# Altium schematic sheet STM32F103C6T7A.SchDoc
size A4
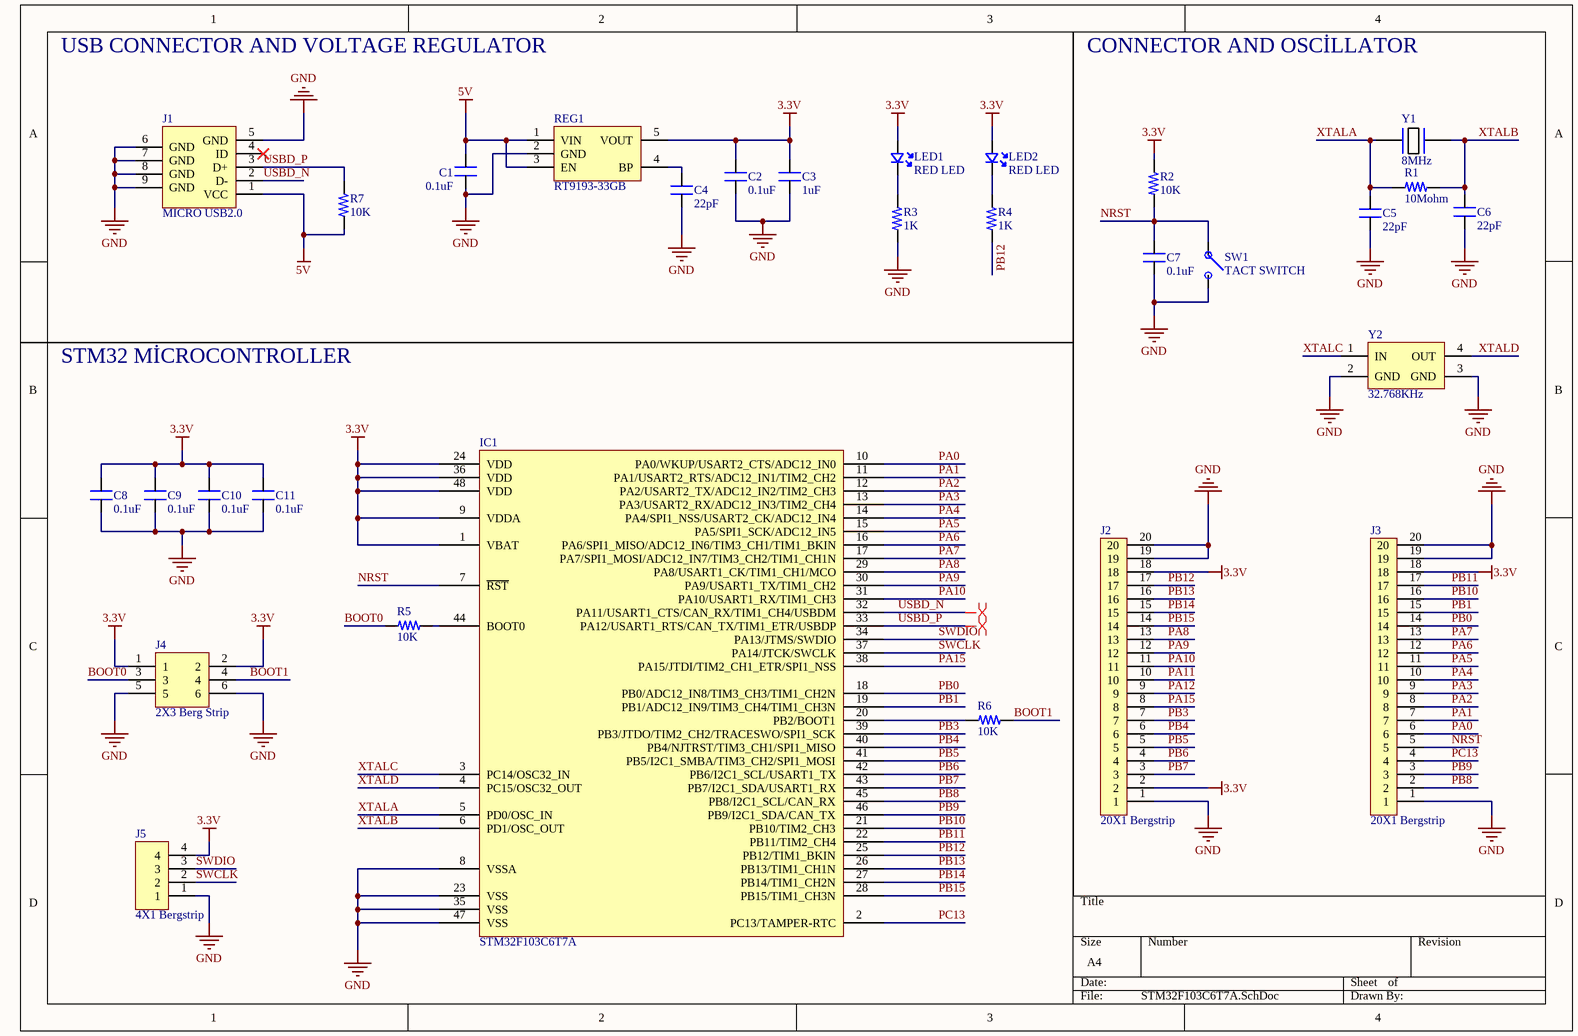
[diagram p0: STM32F103C6T7A.SchDoc]

## Parts
C1  0.1uF  [CAP_0805]
C2  0.1uF  [CAP_0805]
C3  1uF  [CAP_0805]
C4  22pF  [CAP_0805]
C5  22pF  [CAP_0805]
C6  22pF  [CAP_0805]
C7  0.1uF  [CAP_0805]
C8  0.1uF  [CAP_0805]
C9  0.1uF  [CAP_0805]
C10  0.1uF  [CAP_0805]
C11  0.1uF  [CAP_0805]
IC1  STM32F103C6T7A  [ST LQFP-48 7X7MM]
J1  MICRO USB2.0  [CON_10118192-0001LF_SMD]
J2  20X1 Bergstrip  [CON20_100_40D72_TH_ST]
J3  20X1 Bergstrip  [CON20_100_40D72_TH_ST]
J4  2X3 Berg Strip  [CON6_100_59D78_TH_ST_Duplicate]
J5  4X1 Bergstrip  [CON4_100_40D72_TH_ST_MALE]
LED1  RED LED  [LED_0805]
LED2  RED LED  [LED_0805]
R1  10Mohm  [RES_0805]
R2  10K  [RES_0805]
R3  1K  [RES_0805]
R4  1K  [RES_0805]
R5  10K  [RES_0805]
R6  10K  [RES_0805]
R7  10K  [RES_0805]
REG1  RT9193-33GB  [SOT23-5]
SW1  TACT SWITCH  [SW_342_SMD]
Y1  8MHz  [XTAL_314_240X47_SMD]
Y2  32.768KHz  [XTAL_MC-405 32.7680K-G3]

## Nets
3.3V: C2.2 C3.2 C8.2 C9.2 C10.2 C11.2 IC1.1(VBAT) IC1.9(VDDA) IC1.24(VDD) IC1.36(VDD) IC1.48(VDD) J2.2 J2.18 J3.18 J4.1 J4.2 J5.4 LED1.A LED2.A R2.2 REG1.5(VOUT)
5V: C1.2 J1.1(VCC) R7.1 REG1.1(VIN) REG1.3(EN)
GND: C1.1 C2.1 C3.1 C4.1 C5.1 C6.1 C7.1 C8.1 C9.1 C10.1 C11.1 IC1.8(VSSA) IC1.23(VSS) IC1.35(VSS) IC1.47(VSS) J1.5(GND) J1.6(GND) J1.7(GND) J1.8(GND) J1.9(GND) J2.1 J2.19 J2.20 J3.1 J3.19 J3.20 J4.5 J4.6 J5.1 R3.1 REG1.2(GND) SW1.2 Y2.2(GND) Y2.3(GND)
BOOT0: J4.3 R5.1
BOOT1: J4.4 R6.2
NRST: C7.2 IC1.7(~{RST}) J3.5 R2.1 SW1.1
PA0: IC1.10(PA0/WKUP/USART2_CTS/ADC12_IN0) J3.6
PA1: IC1.11(PA1/USART2_RTS/ADC12_IN1/TIM2_CH2) J3.7
PA2: IC1.12(PA2/USART2_TX/ADC12_IN2/TIM2_CH3) J3.8
PA3: IC1.13(PA3/USART2_RX/ADC12_IN3/TIM2_CH4) J3.9
PA4: IC1.14(PA4/SPI1_NSS/USART2_CK/ADC12_IN4) J3.10
PA5: IC1.15(PA5/SPI1_SCK/ADC12_IN5) J3.11
PA6: IC1.16(PA6/SPI1_MISO/ADC12_IN6/TIM3_CH1/TIM1_BKIN) J3.12
PA7: IC1.17(PA7/SPI1_MOSI/ADC12_IN7/TIM3_CH2/TIM1_CH1N) J3.13
PA8: IC1.29(PA8/USART1_CK/TIM1_CH1/MCO) J2.13
PA9: IC1.30(PA9/USART1_TX/TIM1_CH2) J2.12
PA10: IC1.31(PA10/USART1_RX/TIM1_CH3) J2.11
PA11: J2.10
PA12: J2.9
PA15: IC1.38(PA15/JTDI/TIM2_CH1_ETR/SPI1_NSS) J2.8
PB0: IC1.18(PB0/ADC12_IN8/TIM3_CH3/TIM1_CH2N) J3.14
PB1: IC1.19(PB1/ADC12_IN9/TIM3_CH4/TIM1_CH3N) J3.15
PB3: IC1.39(PB3/JTDO/TIM2_CH2/TRACESWO/SPI1_SCK) J2.7
PB4: IC1.40(PB4/NJTRST/TIM3_CH1/SPI1_MISO) J2.6
PB5: IC1.41(PB5/I2C1_SMBA/TIM3_CH2/SPI1_MOSI) J2.5
PB6: IC1.42(PB6/I2C1_SCL/USART1_TX) J2.4
PB7: IC1.43(PB7/I2C1_SDA/USART1_RX) J2.3
PB8: IC1.45(PB8/I2C1_SCL/CAN_RX) J3.2
PB9: IC1.46(PB9/I2C1_SDA/CAN_TX) J3.3
PB10: IC1.21(PB10/TIM2_CH3) J3.16
PB11: IC1.22(PB11/TIM2_CH4) J3.17
PB12: IC1.25(PB12/TIM1_BKIN) J2.17 R4.1
PB13: IC1.26(PB13/TIM1_CH1N) J2.16
PB14: IC1.27(PB14/TIM1_CH2N) J2.15
PB15: IC1.28(PB15/TIM1_CH3N) J2.14
PC13: IC1.2(PC13/TAMPER-RTC) J3.4
SWCLK: IC1.37(PA14/JTCK/SWCLK) J5.2
SWDIO: IC1.34(PA13/JTMS/SWDIO) J5.3
USBD_N: IC1.32(PA11/USART1_CTS/CAN_RX/TIM1_CH4/USBDM) J1.2(D-)
USBD_P: IC1.33(PA12/USART1_RTS/CAN_TX/TIM1_ETR/USBDP) J1.3(D+) R7.2
XTALA: C5.2 IC1.5(PD0/OSC_IN) R1.1 Y1.1
XTALB: C6.2 IC1.6(PD1/OSC_OUT) R1.2 Y1.2
XTALC: IC1.3(PC14/OSC32_IN) Y2.1(IN)
XTALD: IC1.4(PC15/OSC32_OUT) Y2.4(OUT)
NetC4_2: C4.2 REG1.4(BP)
NetIC1_20: IC1.20(PB2/BOOT1) R6.1
NetIC1_44: IC1.44(BOOT0) R5.2
NetLED1_K: LED1.K R3.2
NetLED2_K: LED2.K R4.2

Not connected (* = marked no-connect by the designer): J1 4(ID)*

## Layout directives
differential pair; differential pair class diff_usb: USBD_N, USBD_P

## Notes on the sheet
- USB CONNECTOR AND VOLTAGE REGULATOR
- CONNECTOR AND OSCİLLATOR
- STM32 MİCROCONTROLLER

## Library data of the parts
C1 C2 C7-C11 = CAP_0.1uF-50V-5%-0805: 0.1µF ±5% 50V Ceramic Capacitor X7R 0805 (2012 Metric); Manufacturer: KEMET; Manufacturing Part Number: C0805C104J5RACTU; Case/Package: 0805 (2012 Metric); Supplier-1: Digikey; Supplier Part Number-1: 399-1171-1-ND
C3 = CAP_1uF-50V-5%-0805: 1µF ±5% 50V Ceramic Capacitor X7R 0805 (2012 Metric); Manufacturer: Yageo; Manufacturing Part Number: CC0805JKX7R9BB105; Case/Package: 0805 (2012 Metric); Supplier-1: Digikey; Supplier Part Number-1: 311-3498-1-ND
C4-C6 = CAP_22pF-50V-5%-0805: 22pF ±5% 50V Ceramic Capacitor C0G, NP0 0805 (2012 Metric); Manufacturer: KEMET; Manufacturer Part Number: C0805C220J5GACTU; Case/Package: 0805; Supplier-1: Digikey; Supplier Part Number-1: 399-1113-1-ND
IC1 = STM32F103C6T7A: IC MCU 32BIT 32KB FLASH 48LQFP; Manufacturer: STMicroelectronics; Connectivity: CANbus, I²C, IrDA, LINbus, SPI, UART/USART, USB; Core Processor: ARM® Cortex®-M3; Core Size: 32-Bit; Data Converters: A/D 10x12b; Number of I/O: 37; Oscillator Type: Internal; Peripherals: DMA, Motor Control PWM, PDR, POR, PVD, PWM, Temp Sensor, WDT; Program Memory Size: 32KB (32K x 8); RAM Size: 10K x 8; Speed: 72MHz; Voltage - Supply (Vcc/Vdd): 2V ~ 3.6V; Part Number: STM32F103C6T7A; ComponentLink1Description: Datasheet; ComponentLink1URL: http://www.st.com/content/ccc/resource/technical/document/datasheet/0d/93/e0/d7/77/bf/4c/54/CD00210843.pdf/files/CD00210843.pdf/jcr:content/translations/en.CD00210843.pdf; ComponentLink2Description: DigiKey Link; ComponentLink2URL: //digikey.com/product-detail/en/stmicroelectronics/STM32F103C6T7A/497-11516-ND/2035348; Device Package: 48-LQFP; LastUpdated: 4.12.2019 05:20:26; Lifecycle Status: 0; Minimum Order: 1; Mounting Type: Surface Mount; Operating Temperature: -40°C ~ 105°C (TA); Package / Case: 48-LQFP; Packaging: Tray; PartId: 102; Part Status: Active; Price: 4.52; Program Memory Type: FLASH; Series: STM32F1; Supplier 1: DigiKey; Supplier Part Number 1: 497-11516-ND; Supplier Device Package: 48-LQFP (7x7)
J1 = CON-USB_10118192-0002LF-SMD: USB - micro B USB 2.0 Receptacle Connector 5 Position Surface Mount, Right Angle; Manufacturer: Amphenol ICC (FCI); Manufacturing Part Number: 10118192-0002LF; Case/Package: SMD; Supplier-1: Digikey; Supplier Part Number-1: 609-5379-1-ND
J2 J3 = CON-BS-PLG_20X1-100-TH-ST: 20 pin, 1 row, 2.54mm pitch bergstrip; Manufacturer: NA; Manufacturing Part Number: NA; Case/Package: TH; Supplier-1: NA; Supplier Part Number-1: NA
J4 = CON-BS-PLG_2X3-100-TH-ST: 6 pin, 2 row, 2.54mm pitch bergstrip; Manufacturer: NA; Manufacturer Part Number: NA; Case/Package: TH; Supplier-1: NA; Supplier Part Number-1: NA
J5 = CON-BS-PLG_4X1-100-TH-ST: 4 pin, 1 row, 2.54mm pitch bergstrip; Manufacturer: NA; Manufacturing Part Number: NA; Case/Package: TH; Supplier-1: NA; Supplier Part Number-1: NA
LED1 LED2 = LED-RED_10mA-0805: Red 621nm LED Indication - Discrete 2V 0805 (2012 Metric); Manufacturer: Lite-On Inc.; Manufacturer Part Number: LTST-C170EKT; Case/ Package: 0805; Supplier-1: Digikey; Supplier Part Number-1: 160-1178-1-ND
R1 = RES_10MOHM-0.125W-1%-0805: 10 MOhms ±1% 0.125W, 1/8W Chip Resistor 0805 (2012 Metric) Automotive AEC-Q200, High Voltage Thick Film; Manufacturer: Rohm Semiconductor; Manufacturing Part Number: KTR10EZPF1005; Case/Package: 0805 (2012 Metric); Supplier-1: Digikey; Supplier Part Number-1: RHM10.0MAHCT-ND
R2 R5-R7 = RES_10K-0.125W-1%-0805: 10 kOhms ±1% 0.125W, 1/8W Chip Resistor 0805 (2012 Metric) Moisture Resistant Thick Film; Manufacturer: Yageo; Manufacturing Part Number: RC0805FR-0710KL; Case/Package: 0805; Supplier-1: Digikey; Supplier Part Number-1: 311-10.0KCRCT-ND
R3 R4 = RES_1K-0.125W-1%-0805: 1 kOhms ±1% 0.125W, 1/8W Chip Resistor 0805 (2012 Metric) Moisture Resistant Thick Film; Manufacturer: 垈㎵á; Manufacturer Part Number: RC0805FR-071KL; Case/Package: 0805; Supplier-1: Digikey; Supplier Part Number-1: 311-1.00KCRCT-ND
REG1 = REG_3.3V-5.5V-0.3A-SOT-23-5: Linear Voltage Regulator IC 1 Output 300mA SOT-23-5; Manufacturer: Richtek USA Inc.; Manufacturer Part Number: RT9193-33GB; Case/ Package: SOT-23-5; Supplier-1: Digikey; Supplier Part Number-1: 1028-1014-1-ND
SW1 = SW_KSR223GLFG-SMD: Tactile Switch SPST-NO Top Actuated Surface Mount; Manufacturer: C&K; Manufacturing Part Number: KSR223GLFG; Case/Package: SMD; Supplier-1: Digikey; Supplier Part Number-1: 401-1704-1-ND
Y1 = XTAL_8MHZ-LFXTAL030234: Crystals 8MHz 22pF -20C 70C; Manufacturer: IQD Frequency Products; Manufacturing Part Number: LFXTAL030234Reel; Case/Package: SMD; Supplier-1: Mouser; Supplier Part Number-1: 449-LFXTAL030234REEL
Y2 = XTAL_32.768KHz-MC-405 32.7680K-G3: Crystals SMD AT XTL MHZ +/-50PPM 12.5 PF 250 T/R; Manufacturer: Epson; Manufacturing Part Number: MC-405 32.7680K-G3: ROHS; Case/Package: SMD; Supplier-1: Mouser; Supplier Part Number-1: 732-MC405327680KG3RS